# Altium schematic sheet 11_HEATER.SchDoc
size 420 x 297 mm; SheetNumber: 18; SheetTotal: 28
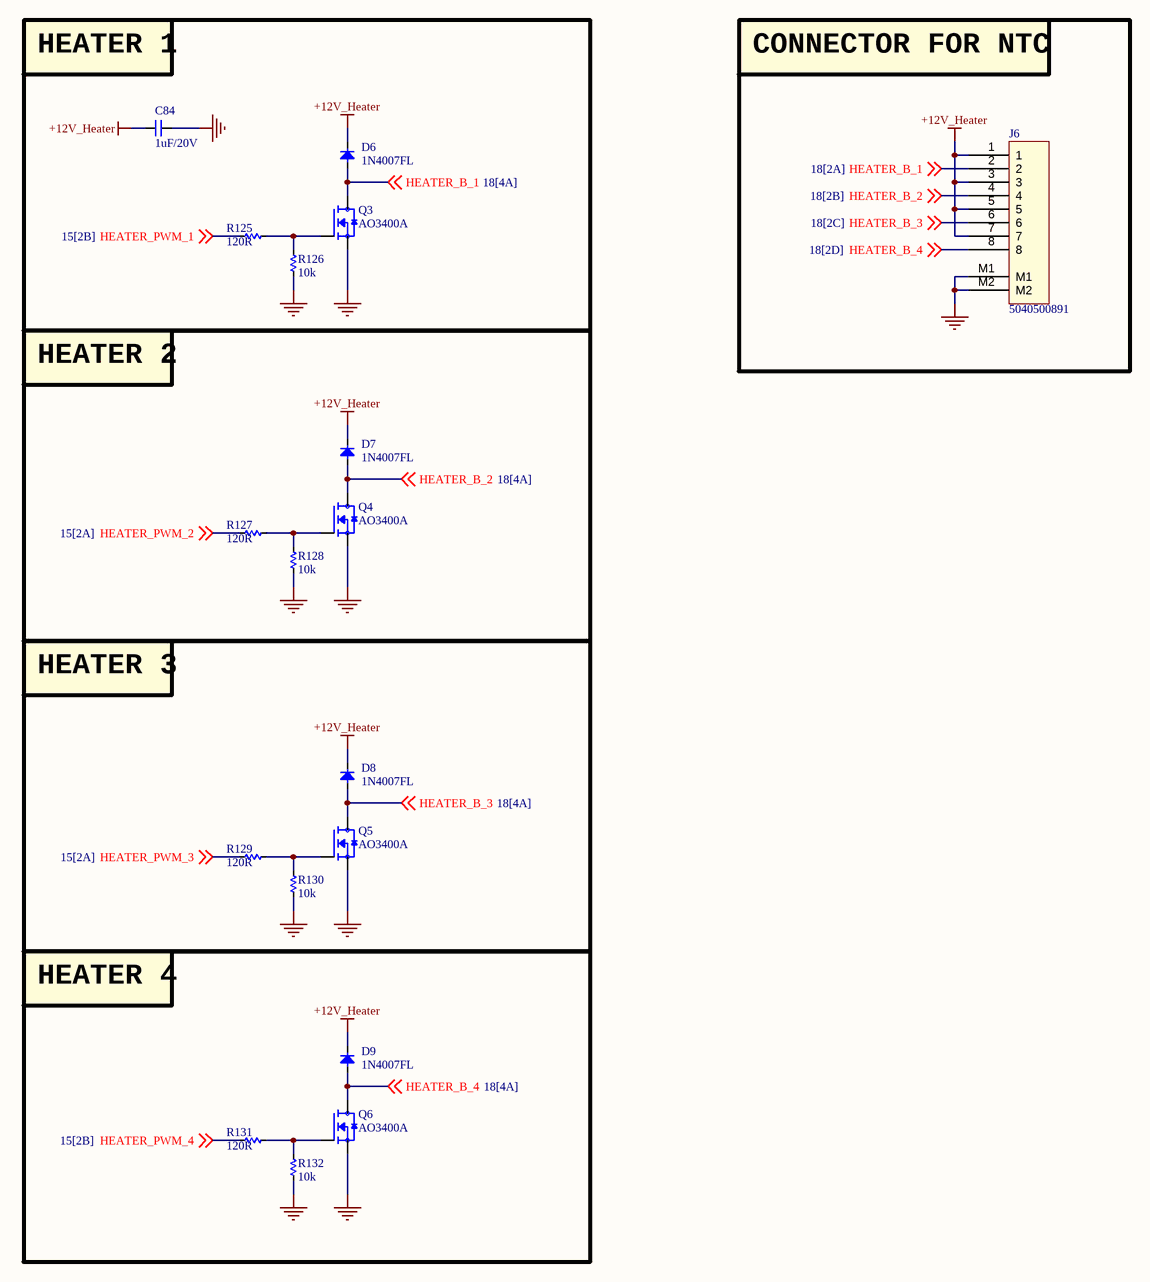
[diagram p0: 11_HEATER.SchDoc]

## Parts
C84  1uF/20V  [CAP_C_1005X60]
D6  1N4007FL  [SOD3717X145N]
D7  1N4007FL  [SOD3717X145N]
D8  1N4007FL  [SOD3717X145N]
D9  1N4007FL  [SOD3717X145N]
J6  5040500891  [MOLEX_5040500891]
Q3  AO3400A  [SOT95P240X120-3N]
Q4  AO3400A  [SOT95P240X120-3N]
Q5  AO3400A  [SOT95P240X120-3N]
Q6  AO3400A  [SOT95P240X120-3N]
R125  120R  [RES_C_1005X40]
R126  10k  [RES_C_1005X40]
R127  120R  [RES_C_1005X40]
R128  10k  [RES_C_1005X40]
R129  120R  [RES_C_1005X40]
R130  10k  [RES_C_1005X40]
R131  120R  [RES_C_1005X40]
R132  10k  [RES_C_1005X40]

## Blocks framed on the sheet
HEATER 1: C84 D6 Q3 R125 R126
CONNECTOR FOR NTC: J6
HEATER 2: D7 Q4 R127 R128
HEATER 3: D8 Q5 R129 R130
HEATER 4: D9 Q6 R131 R132

## Nets
+12V_Heater: C84.2 D6.1(K) D7.1(K) D8.1(K) D9.1(K) J6.1 J6.3 J6.5 J6.7
GND: C84.1 J6.M1 J6.M2 Q3.2(S) Q4.2(S) Q5.2(S) Q6.2(S) R126.1 R128.1 R130.1 R132.1
HEATER_B_1: D6.2(A) J6.2 Q3.3(D) ; off-sheet HEATER_B_1
HEATER_B_2: D7.2(A) J6.4 Q4.3(D) ; off-sheet HEATER_B_2
HEATER_B_3: D8.2(A) J6.6 Q5.3(D) ; off-sheet HEATER_B_3
HEATER_B_4: D9.2(A) J6.8 Q6.3(D) ; off-sheet HEATER_B_4
HEATER_PWM_1: R125.1 ; off-sheet HEATER_PWM_1
HEATER_PWM_2: R127.1 ; off-sheet HEATER_PWM_2
HEATER_PWM_3: R129.1 ; off-sheet HEATER_PWM_3
HEATER_PWM_4: R131.1 ; off-sheet HEATER_PWM_4
NetQ3_1: Q3.1(G) R125.2 R126.2
NetQ4_1: Q4.1(G) R127.2 R128.2
NetQ5_1: Q5.1(G) R129.2 R130.2
NetQ6_1: Q6.1(G) R131.2 R132.2

## Notes on the sheet
- Project:
- Sub-system:
- Design by:
- Sheet title:
- Sheet
- of
- Checked by:
- Approved by:
- Revision:
- Document No:
- Size:
- Date:
- A3

## Library data of the parts
C84 = _CAP_C_2: CAP CHIP
D6-D9 = Diode SMD: Default Diode; Code - JEDEC: DO-214-AB; Value: 1N5007; Published: 8-Jun-2000; Revision: July-2002: Re-released for DXP Platform.; Publisher: Altium Limited
J6 = Header 8x1_2M
Q3-Q6 = MOSFET_N: N-Channel 30 V 5.7A (Ta) 1.4W (Ta) Surface Mount SOT-23-3; MF: Alpha & Omega Semiconductor; SnapEDA_Link: https://www.snapeda.com/parts/AO3400A/Alpha/view-part/?ref=snap; Package: SOT-23 Alpha &amp; Omega Semiconductor Inc.; Value: *; MP: AO3400A; Check_prices: https://www.snapeda.com/parts/AO3400A/Alpha/view-part/?ref=eda
R125-R132 = _RES_B_2: RES